# EAGLE design basic (EAGLE 9.6.2)
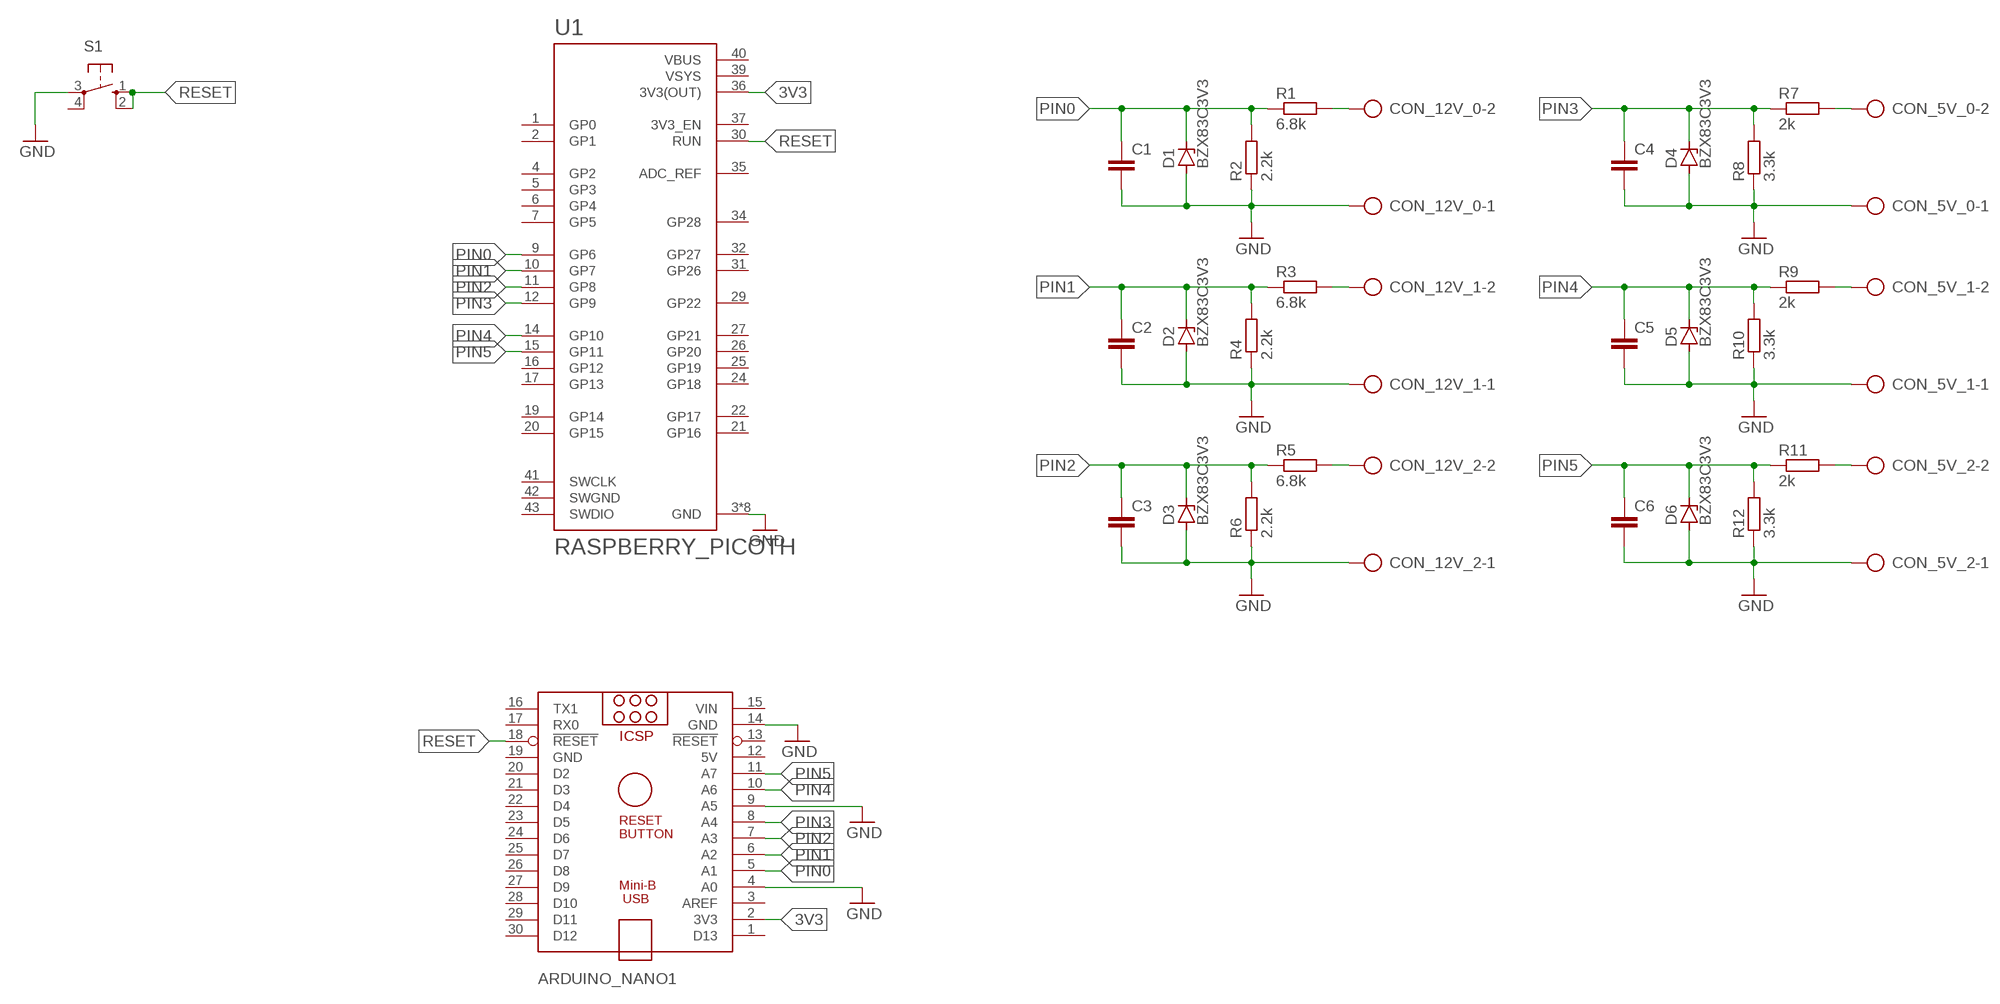
[diagram p0: schematic, sheet 1]

## Parts
ARDUINO_NANO1  ARDUINO_NANO  [ARDUINO_NANO]
C1  C-EU025-050X050  [C025-050X050]
C2  C-EU025-050X050  [C025-050X050]
C3  C-EU025-050X050  [C025-050X050]
C4  C-EU025-050X050  [C025-050X050]
C5  C-EU025-050X050  [C025-050X050]
C6  C-EU025-050X050  [C025-050X050]
CON_5V_0  AK300/2  [AK300/2]
CON_5V_1  AK300/2  [AK300/2]
CON_5V_2  AK300/2  [AK300/2]
CON_12V_0  AK300/2  [AK300/2]
CON_12V_1  AK300/2  [AK300/2]
CON_12V_2  AK300/2  [AK300/2]
D1  BZX83C3V3  BZX857  [DO41Z7.6]
D2  BZX83C3V3  BZX857  [DO41Z7.6]
D3  BZX83C3V3  BZX857  [DO41Z7.6]
D4  BZX83C3V3  BZX857  [DO41Z7.6]
D5  BZX83C3V3  BZX857  [DO41Z7.6]
D6  BZX83C3V3  BZX857  [DO41Z7.6]
R1  6.8k  R-EU_0207/7  [0207/7]
R2  2.2k  R-EU_0207/7  [0207/7]
R3  6.8k  R-EU_0207/7  [0207/7]
R4  2.2k  R-EU_0207/7  [0207/7]
R5  6.8k  R-EU_0207/7  [0207/7]
R6  2.2k  R-EU_0207/7  [0207/7]
R7  2k  R-EU_0207/7  [0207/7]
R8  3.3k  R-EU_0207/7  [0207/7]
R9  2k  R-EU_0207/7  [0207/7]
R10  3.3k  R-EU_0207/7  [0207/7]
R11  2k  R-EU_0207/7  [0207/7]
R12  3.3k  R-EU_0207/7  [0207/7]
S1  10-XX  [B3F-10XX]
U1  RASPBERRY_PICOTH  [PICO-PKG-TH]

## Nets
3V3: ARDUINO_NANO1.2(3V3) U1.36(3V3(OUT))
GND: ARDUINO_NANO1.4(A0) ARDUINO_NANO1.9(A5) ARDUINO_NANO1.14(GND) C1.2 C2.2 C3.2 C4.2 C5.2 C6.2 CON_5V_0.1 CON_5V_1.1 CON_5V_2.1 CON_12V_0.1 CON_12V_1.1 CON_12V_2.1 D1.A D2.A D3.A D4.A D5.A D6.A R2.1 R4.1 R6.1 R8.1 R10.1 R12.1 S1.3(P) U1.3(GND) U1.8(GND) U1.13(GND) U1.18(GND) U1.23(GND) U1.28(GND) U1.33(GND) U1.38(GND)
N$1: CON_12V_0.2 R1.2
N$2: CON_12V_1.2 R3.2
N$3: CON_12V_2.2 R5.2
N$4: CON_5V_0.2 R7.2
N$5: CON_5V_1.2 R9.2
N$6: CON_5V_2.2 R11.2
PIN0: ARDUINO_NANO1.5(A1) C1.1 D1.C R1.1 R2.2 U1.9(GP6)
PIN1: ARDUINO_NANO1.6(A2) C2.1 D2.C R3.1 R4.2 U1.10(GP7)
PIN2: ARDUINO_NANO1.7(A3) C3.1 D3.C R5.1 R6.2 U1.11(GP8)
PIN3: ARDUINO_NANO1.8(A4) C4.1 D4.C R7.1 R8.2 U1.12(GP9)
PIN4: ARDUINO_NANO1.10(A6) C5.1 D5.C R9.1 R10.2 U1.14(GP10)
PIN5: ARDUINO_NANO1.11(A7) C6.1 D6.C R11.1 R12.2 U1.15(GP11)
RESET: ARDUINO_NANO1.18(!RESET) S1.1(S) S1.2(S1) U1.30(RUN)
Unconnected: ARDUINO_NANO1.1(D13) ARDUINO_NANO1.3(AREF) ARDUINO_NANO1.13(!RESET) ARDUINO_NANO1.16(TX1) ARDUINO_NANO1.17(RX0) ARDUINO_NANO1.20(D2) ARDUINO_NANO1.21(D3) ARDUINO_NANO1.22(D4) ARDUINO_NANO1.23(D5) ARDUINO_NANO1.24(D6) ARDUINO_NANO1.25(D7) ARDUINO_NANO1.26(D8) ARDUINO_NANO1.27(D9) ARDUINO_NANO1.28(D10) ARDUINO_NANO1.29(D11) ARDUINO_NANO1.30(D12) S1.4(P1) U1.1(GP0) U1.2(GP1) U1.4(GP2) U1.5(GP3) U1.6(GP4) U1.7(GP5) U1.16(GP12) U1.17(GP13) U1.19(GP14) U1.20(GP15) U1.21(GP16) U1.22(GP17) U1.24(GP18) U1.25(GP19) U1.26(GP20) U1.27(GP21) U1.29(GP22) U1.31(GP26) U1.32(GP27) U1.34(GP28) U1.35(ADC_REF) U1.37(3V3_EN) U1.41(SWCLK) U1.43(SWDIO)

## Power pins joined to a net without a drawn wire
5V: ARDUINO_NANO1.12(5V)
GND: ARDUINO_NANO1.19(GND)
SWGND: U1.42(SWGND)
VBUS: U1.40(VBUS)
VIN: ARDUINO_NANO1.15(VIN)
VSYS: U1.39(VSYS)

## Library data of the parts
ARDUINO_NANO1 = ArduinoNanoV30:ARDUINO_NANO: Arduino Nano V3.0 Overview: The Arduino Nano is a small, complete, and breadboard-friendly board based on the ATmega328 (Arduino Nano 3.x) or ATmega168 (Arduino Nano 2.x). It has more or less the same functionality of the Arduino Duemilanove, but in a different package. It lacks only a DC power jack, and works with a Mini-B USB cable instead of a standard one. The Nano was designed and is being produced by Gravitech. Specifications: Microcontroller Atmel ATmega168 or ATmega328 Operating Voltage (logic level) 5 V Input Voltage (recommended) 7-12 V Input Voltage (limits) 6-20 V Digital I/O Pins 14 (of which 6 provide PWM output) Analog Input Pins 8 DC Current per I/O Pin 40 mA Flash Memory 16 KB (ATmega168) or 32 KB (ATmega328) of which 2 KB used by bootloader SRAM 1 KB (ATmega168) or 2 KB (ATmega328) EEPROM 512 bytes (ATmega168) or 1 KB (ATmega328) Clock Speed 16 MHz Dimensions 0.73" x 1.70" Length 45 mm Width 18 mm Weigth 5 g Power: The Arduino Nano can be powered via the Mini-B USB connection, 6-20V unregulated external power supply (pin 30), or 5V regulated external power supply (pin 27). The power source is automatically selected to the highest voltage source. Memory: The ATmega168 has 16 KB of flash memory for storing code (of which 2 KB is used for the bootloader); the ATmega328 has 32 KB, (also with 2 KB used for the bootloader). The ATmega168 has 1 KB of SRAM and 512 bytes of EEPROM (which can be read and written with the EEPROM library); the ATmega328 has 2 KB of SRAM and 1 KB of EEPROM. Input and Output: Each of the 14 digital pins on the Nano can be used as an input or output, using pinMode(), digitalWrite(), and digitalRead() functions. They operate at 5 volts. Each pin can provide or receive a maximum of 40 mA and has an internal pull-up resistor (disconnected by default) of 20-50 kOhms. In addition, some pins have specialized functions. Visit Arduino - ArduinoBoardNano <https://www.arduino.cc/en/Main/ArduinoBoardNano>
C1-C6 = rcl:C-EU: CAPACITOR, European symbol; SPICEPREFIX: C
CON_5V_0 CON_5V_1 CON_5V_2 CON_12V_0 CON_12V_1 CON_12V_2 = con-ptr500-custom:AK300/2: CONNECTOR; OC_FARNELL: unknown; OC_NEWARK: unknown
D1-D6 = diode-custom:BZX85: Z DIODE
R1-R12 = rcl:R-EU_: RESISTOR, European symbol; SPICEPREFIX: R
S1 = switch-omron:10-XX: OMRON SWITCH; MPN: B3F-1000; OC_FARNELL: 176432; OC_NEWARK: 36M3542
U1 = RpiPico:RASPBERRY_PICO: Raspberry Pi Pico

## Board
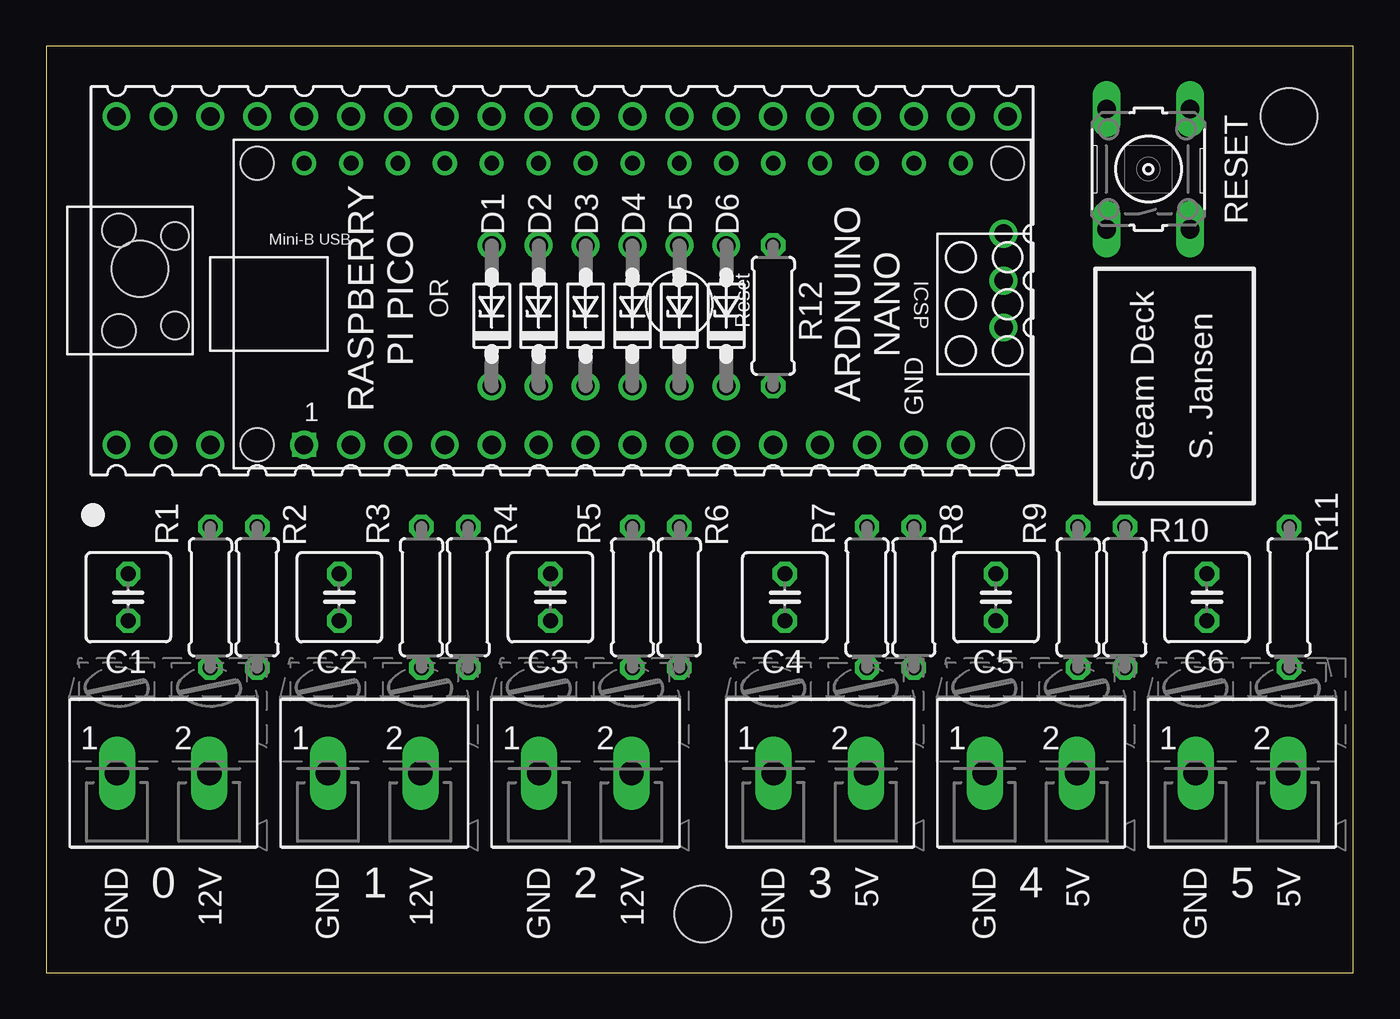
[diagram p1: board, top side]
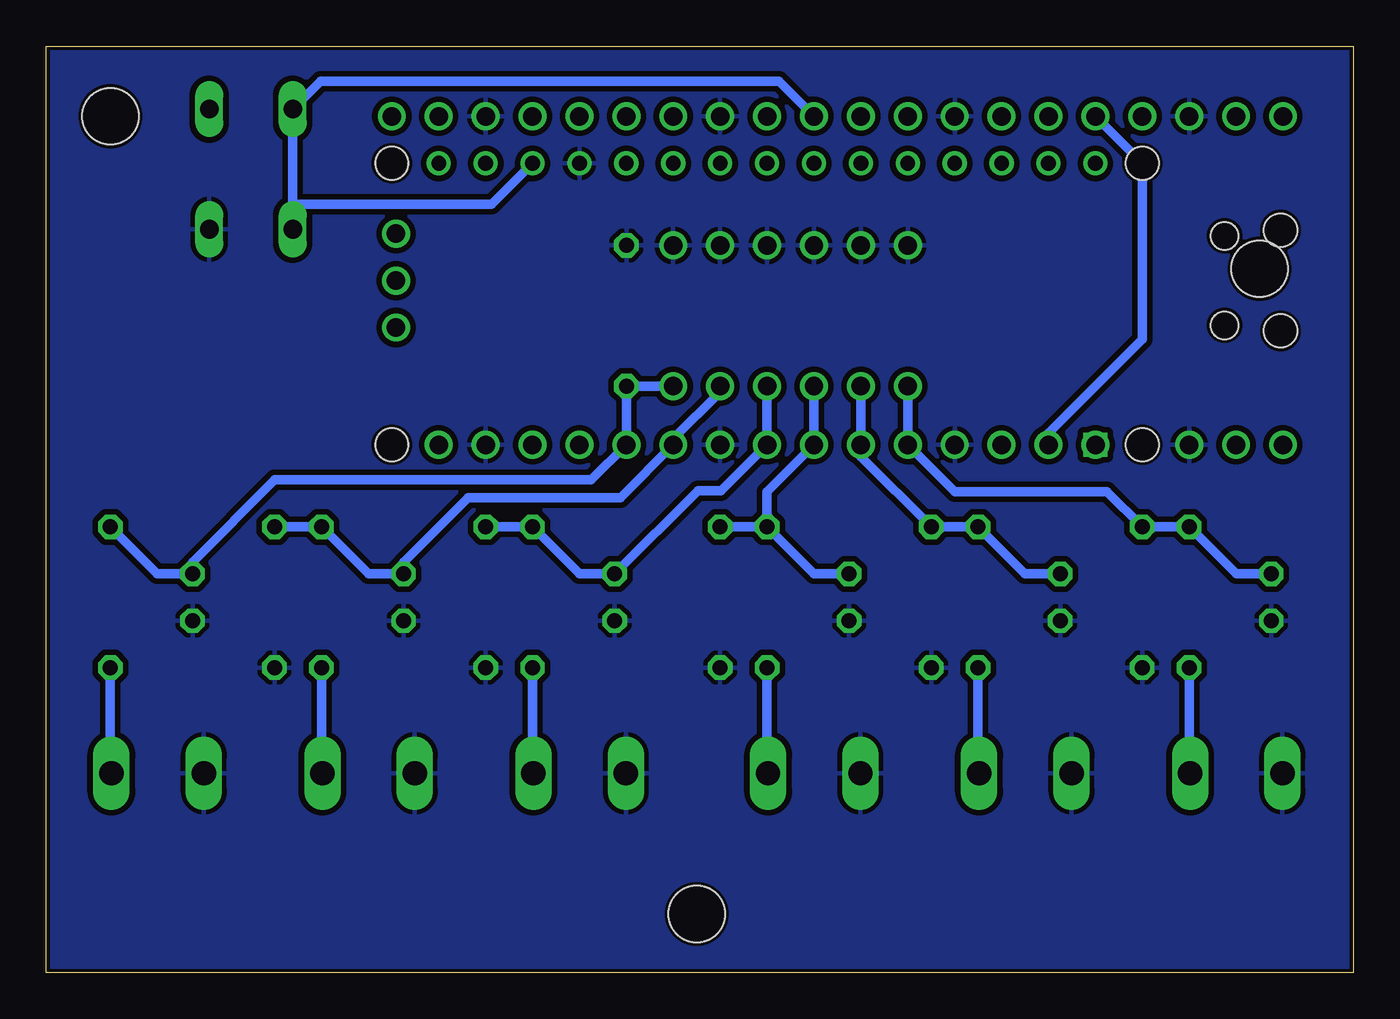
[diagram p2: board, bottom side, seen from below]

Size 70.79 x 50.16 mm. Coordinates in mm from the lower left corner, seen from the top.
Outline: 0,0 70.79,0 70.79,50.16 0,50.16 0,0
Copper layers (1*16): Top 0.035mm / dielectric 1.5mm / Bottom 0.035mm
Design rules "home-made-pcb": minimum track width 8mil, minimum drill 0.3mm, track to track 12mil, track to pad 8mil, pad to pad 10mil, via to via 10mil, smd to smd 6mil, copper to edge 8mil, drill to drill 10mil, minimum pad ring 10mil, minimum via ring 20mil, stop-mask expansion 4mil, vias tented up to drill 0mil, thermal gap 10mil
Holes 3.05 mm at 67.31,46.35 5.08,38.1 35.56,3.17

### Footprints (pad centres in the part's own frame; a part is rotated, then mirrored left to right if it is on the bottom)
ARDUINO_NANO = drill 0.8 square: 1 -20.32,-7.62 | drill 0.8: 2 -17.78,-7.62; 3 -15.24,-7.62; 4 -12.7,-7.62; 5 -10.16,-7.62; 6 -7.62,-7.62; 7 -5.08,-7.62; 8 -2.54,-7.62; 9 0,-7.62; 10 2.54,-7.62; 11 5.08,-7.62; 12 7.62,-7.62; 13 10.16,-7.62; 14 12.7,-7.62; 15 15.24,-7.62; 16 15.24,7.62; 17 12.7,7.62; 18 10.16,7.62; 19 7.62,7.62; 20 5.08,7.62; 21 2.54,7.62; 22 0,7.62; 23 -2.54,7.62; 24 -5.08,7.62; 25 -7.62,7.62; 26 -10.16,7.62; 27 -12.7,7.62; 28 -15.24,7.62; 29 -17.78,7.62; 30 -20.32,7.62 | hole 1.778: -22.86,-7.62; -22.86,7.62; 17.78,7.62; 17.78,-7.62
C025-050X050 = drill 0.813 octagon: 1 -1.27,0; 2 1.27,0
AK300/2 = drill 1.321 long: 1 -2.515,0; 2 2.489,0
DO41Z7.6 = drill 1: A 3.81,0; C -3.81,0
0207/7 = drill 0.813 octagon: 1 -3.81,0; 2 3.81,0
B3F-10XX = drill 1.016 long: 1 -3.251,2.261; 2 3.251,2.261; 3 -3.251,-2.261; 4 3.251,-2.261
PICO-PKG-TH = drill 1: 1 -8.89,24.13; 2 -8.89,21.59; 3 -8.89,19.05; 4 -8.89,16.51; 5 -8.89,13.97; 6 -8.89,11.43; 7 -8.89,8.89; 8 -8.89,6.35; 9 -8.89,3.81; 10 -8.89,1.27; 11 -8.89,-1.27; 12 -8.89,-3.81; 13 -8.89,-6.35; 14 -8.89,-8.89; 15 -8.89,-11.43; 16 -8.89,-13.97; 17 -8.89,-16.51; 18 -8.89,-19.05; 19 -8.89,-21.59; 20 -8.89,-24.13; 21 8.89,-24.13; 22 8.89,-21.59; 23 8.89,-19.05; 24 8.89,-16.51; 25 8.89,-13.97; 26 8.89,-11.43; 27 8.89,-8.89; 28 8.89,-6.35; 29 8.89,-3.81; 30 8.89,-1.27; 31 8.89,1.27; 32 8.89,3.81; 33 8.89,6.35; 34 8.89,8.89; 35 8.89,11.43; 36 8.89,13.97; 37 8.89,16.51; 38 8.89,19.05; 39 8.89,21.59; 40 8.89,24.13; 41 -2.54,-23.9; 42 0,-23.9; 43 2.54,-23.9 | hole 1.8: -2.725,24; 2.725,24 | hole 1.5: -2.425,20.97; 2.425,20.97

### Placement (x,y rotation side)
ARDUINO_NANO1  34.29,36.2 0 top
C1  4.45,20.32 270 top
C2  15.88,20.32 270 top
C3  27.3,20.32 270 top
C4  40.01,20.32 270 top
C5  51.44,20.32 270 top
C6  62.87,20.32 270 top
CON_5V_0  41.91,10.79 0 top
CON_5V_1  53.34,10.79 0 top
CON_5V_2  64.77,10.79 0 top
CON_12V_0  6.35,10.79 0 top
CON_12V_1  17.78,10.79 0 top
CON_12V_2  29.21,10.79 0 top
D1  24.13,35.56 90 top
D2  26.67,35.56 90 top
D3  29.21,35.56 90 top
D4  31.75,35.56 90 top
D5  34.29,35.56 90 top
D6  36.83,35.56 90 top
R1  8.89,20.32 270 top
R2  11.43,20.32 90 top
R3  20.32,20.32 270 top
R4  22.86,20.32 90 top
R5  31.75,20.32 270 top
R6  34.29,20.32 90 top
R7  44.45,20.32 270 top
R8  46.99,20.32 90 top
R9  55.88,20.32 270 top
R10  58.42,20.32 90 top
R11  67.31,20.32 270 top
R12  39.37,35.56 270 top
S1  59.69,43.5 90 top
U1  27.94,37.47 90 top

### Tracks (layer width: path | path; a pad name or v marks a point on that pad's centre or on a via)
3V3
  Bottom 0.508: ARDUINO_NANO1.2 16.51,29.21 11.43,34.29 11.43,43.81 U1.36
GND
  pour Bottom: 0,50.16 0,0 71.12,0 71.12,50.16
N$1
  Bottom 0.508: R1.2 8.89,10.85 CON_12V_0.2
N$2
  Bottom 0.508: R3.2 20.32,10.85 CON_12V_1.2
N$3
  Bottom 0.508: R5.2 31.75,10.85 CON_12V_2.2
N$4
  Bottom 0.508: R7.2 44.45,10.85 CON_5V_0.2
N$5
  Bottom 0.508: R9.2 55.88,10.85 CON_5V_1.2
N$6
  Bottom 0.508: R11.2 67.31,10.85 CON_5V_2.2
PIN0
  Bottom 0.508: R1.1 9.08,24.13 | D1.C ARDUINO_NANO1.5 21.59,26.04 13.34,26.04 R2.2 R1.1 | C1.1 6.35,21.59 R1.1
PIN1
  Bottom 0.508: D2.C ARDUINO_NANO1.6 26.67,27.94 R4.2 R3.1 17.78,21.59 C2.1
PIN2
  Bottom 0.508: D3.C ARDUINO_NANO1.7 31.75,26.04 R5.1 | R6.2 R5.1 | R5.1 29.21,21.59 C3.1
PIN3
  Bottom 0.508: R8.2 R7.1 41.91,21.59 C4.1 35.5,26.09 34.23,26.09 ARDUINO_NANO1.8 D4.C
PIN4
  Bottom 0.508: R10.2 R9.1 53.34,21.59 C5.1 51.44,22.23 47.94,25.72 39.69,25.72 ARDUINO_NANO1.10 36.83,28.89 34.29,31.43 D5.C
PIN5
  Bottom 0.508: D6.C R12.2 ARDUINO_NANO1.11 41.27,26.67 58.42,26.67 62.87,22.23 C6.1 64.77,21.59 R11.1
RESET
  Bottom 0.508: U1.30 31.11,48.26 55.92,48.26 S1.2 57.43,41.59 | S1.1 57.43,41.59 | 57.43,41.59 46.67,41.59 ARDUINO_NANO1.18

### Text on the board
tNames: RESET | RASPBERRY / PI PICO | OR | ARDNUINO / NANO | Stream Deck | S. Jansen | GND | GND | 0 | 12V | GND | 1 | 12V | GND | 2 | 12V | GND | 3 | 5V | GND | 4 | 5V | GND | 5 | 5V